# Altium project PCB_Project_1.PrjPcb
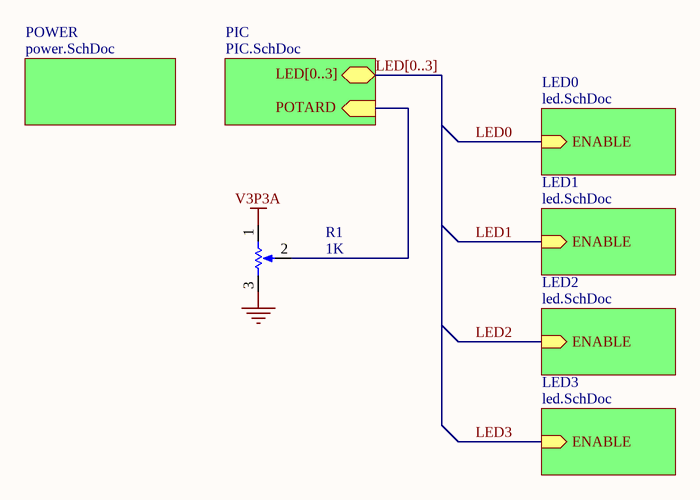
[diagram p0: TP2.SchDoc]
4 sheets, 34 parts. Net scope: hierarchical (ports join the sheet entries above them; power ports are global).
Sheets:
  TP2.SchDoc
    POWER = power.SchDoc
    PIC = PIC.SchDoc
    LED3 = led.SchDoc
    LED2 = led.SchDoc
    LED1 = led.SchDoc
    LED0 = led.SchDoc

## Sheet TP2.SchDoc
size A

### Parts
R1  1K  [PDB181-K415K-102A2]

### Sub-sheets
LED0 = led.SchDoc: ENABLE (in)
LED1 = led.SchDoc: ENABLE (in)
LED2 = led.SchDoc: ENABLE (in)
LED3 = led.SchDoc: ENABLE (in)
PIC = PIC.SchDoc: no entries
POWER = power.SchDoc: no entries

### Ports


### Nets
GND: R1.3(TOP)
V3P3A: R1.1(BOT)
NetR1_2: R1.2(TAP) ; port 

### Buses and harness runs
bus LED[0..3]
bus LED[0..3] = port 

### Notes on the sheet
- Labels drawn without touching a wire or pin: LED[0..3], POTARD

### Library data of the parts
R1 = RPot: Potentiometer; Sim Note: Enter the Resistance value and the set point into parameter fields.; Set Position: 0.5; Fabricant: BOURNS; Fournisseur: Farnell; RefFournisseur: 1823540; Published: 8-Jun-2000; LatestRevisionDate: 17-Jul-2002; LatestRevisionNote: Re-released for DXP Platform.; PackageReference: VR5; Publisher: Altium Limited; PackageDescription: Variable Resistor, Thru-Hole; 3 Leads; RefFabricant: PDB181-K415K-102A2

## Sheet power.SchDoc
size A
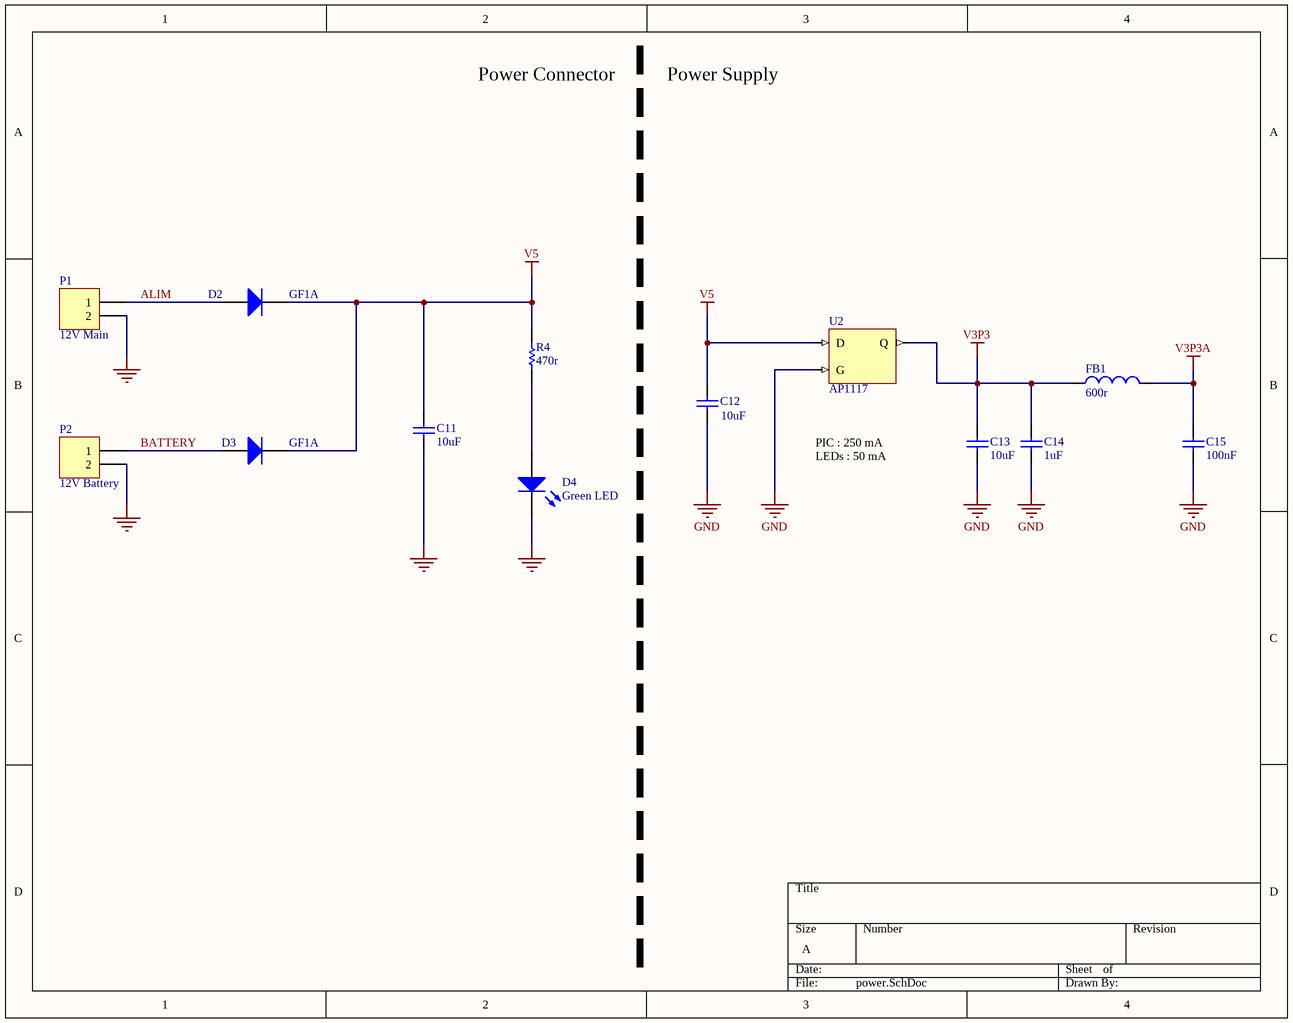
[diagram p1: power.SchDoc]

### Parts
C11  10uF  [CAPC2012N]
C12  10uF  [CAPC2012N]
C13  10uF  [CAPC2012N]
C14  1uF  [CAPC1608N]
C15  100nF  [RAD-0.3]
D2  GF1A  [SMA/DO-214AC_21]
D3  GF1A  [SMA/DO-214AC_21]
D4  Green LED  [LED 0805]
FB1  600r  [INDC1608AN]
P1  12V Main  [PHOENIX_1985195]
P2  12V Battery  [PHOENIX_1985195]
R4  470r  [RESC1608N]
U2  AP1117  [TD03B_N]

### Nets
GND: C11.1 C12.1 C13.1 C14.1 C15.1 D4.2(K) P1.2 P2.2 U2.G
V3P3: C13.2 C14.2 FB1.1 U2.Q
V3P3A: C15.2 FB1.2
V5: C11.2 C12.2 D2.2(K) D3.2(K) R4.2 U2.D
ALIM: D2.1(A) P1.1
BATTERY: D3.1(A) P2.1
NetD4_1: D4.1(A) R4.1

### Notes on the sheet
- Power Connector
- Power Supply
- PIC : 250 mA
- LEDs : 50 mA

### Library data of the parts
C11-C13 = Cap: Capacitor; Fabricant: TDK; RefFabricant: C2012X5R0J106M/1.25; Fournisseur: Farnell; RefFournisseur: 2309029; Precision: 6,3V X5R; Published: 8-Jun-2000; LatestRevisionDate: 17-Jul-2002; LatestRevisionNote: Re-released for DXP Platform.; PackageReference: RAD-0.3; Publisher: Altium Limited; PackageDescription: Radial Cap, Thru-Hole; 2 Leads; 0.3 in Pin Spacing; Value: 10uF
C14 = Cap: Capacitor; Precision: 6,3V X5R; Published: 8-Jun-2000; LatestRevisionDate: 17-Jul-2002; LatestRevisionNote: Re-released for DXP Platform.; PackageReference: RAD-0.3; Publisher: Altium Limited; PackageDescription: Radial Cap, Thru-Hole; 2 Leads; 0.3 in Pin Spacing; Value: 1uF
C15 = Cap: Capacitor; Value: 100pF; Published: 8-Jun-2000; LatestRevisionDate: 17-Jul-2002; LatestRevisionNote: Re-released for DXP Platform.; PackageReference: RAD-0.3; Publisher: Altium Limited; PackageDescription: Radial Cap, Thru-Hole; 2 Leads; 0.3 in Pin Spacing
D2 D3 = Diode: Default Diode; Fabricant: VISHAY; RefFabricant: GF1A-E3/67A; Fournisseur: Farnell; RefFournisseur: 9549560; Published: 8-Jun-2000; LatestRevisionDate: 17-Jul-2002; LatestRevisionNote: Re-released for DXP Platform.; PackageVersion: Sep-1996; PackageReference: SMC; Publisher: Altium Limited; PackageDescription: DO-214-AB/SMC; 2 C-Bend Leads; Body 7.9 x 5.9 mm, inc. leads (LxW); Code_JEDEC: DO-214-AB
D4 = LED2: Typical RED, GREEN, YELLOW, AMBER GaAs LED; Fabricant: KINGBRIGHT; RefFabricant: KPT-2012SGC; Fournisseur: Farnell; RefFournisseur: 2099239; Published: 8-Jun-2000; LatestRevisionDate: 17-Jul-2002; LatestRevisionNote: Re-released for DXP Platform.; PackageVersion: Feb-2002; PackageReference: 3.2X1.6X1.1; Publisher: Altium Limited; PackageDescription: SM LED; 2 Flat Leads
FB1 = Inductor: Code_IEC: 1005; Value: 10mH; Fabricant: Wurth; RefFabricant: 742792651; Fournisseur: Farnell; RefFournisseur: 1635706; Published: 8-Jun-2000; LatestRevisionDate: 29-May-2009; LatestRevisionNote: IPC-7351 Footprint Added.; PackageReference: 0402-A; Publisher: Altium Limited; PackageDescription: Chip Inductor; Code_JEITA: 0402
P1 P2 = Header 2: Header, 2-Pin; Fabricant: PHOENIX CONTACT; RefFabricant: PTSA 1.5/2-3,5-Z; Fournisseur: Farnell; RefFournisseur: 1792769; LatestRevisionDate: 17-Jul-2002; LatestRevisionNote: Re-released for DXP Platform.; Publisher: Altium Limited
R4 = Res1: Resistor; Value: 1K; Precision: 1%; Published: 8-Jun-2000; LatestRevisionDate: 17-Jul-2002; LatestRevisionNote: Re-released for DXP Platform.; PackageReference: AXIAL-0.3; Publisher: Altium Limited; PackageDescription: Axial Device, Thru-Hole; 2 Leads; 0.3 in Pin Spacing
U2 = LD: 1A LDO, 18V input, DPAK; FunctionalClass: Latch; ArchiveName: GENERIC; VHDLIB_SIM: GENERIC_LIB; Fabricant: DIODES INC; RefFabricant: AP1117D33G-13; Fournisseur: Farnell; RefFournisseur: 1825285; Published: 29-Jan-2004; Publisher: Altium Limited; XilinxEquivalent: LD; LastRevisionNo: 1.00.00; HelpURL: CR0118 FPGA Generic Library Guide.pdf#page=310; ComponentLink1URL: CR0135 FPGA Latch Resource Usage.pdf#page=2; ComponentLink1Description: Core &Resource Usage

## Sheet PIC.SchDoc
size A
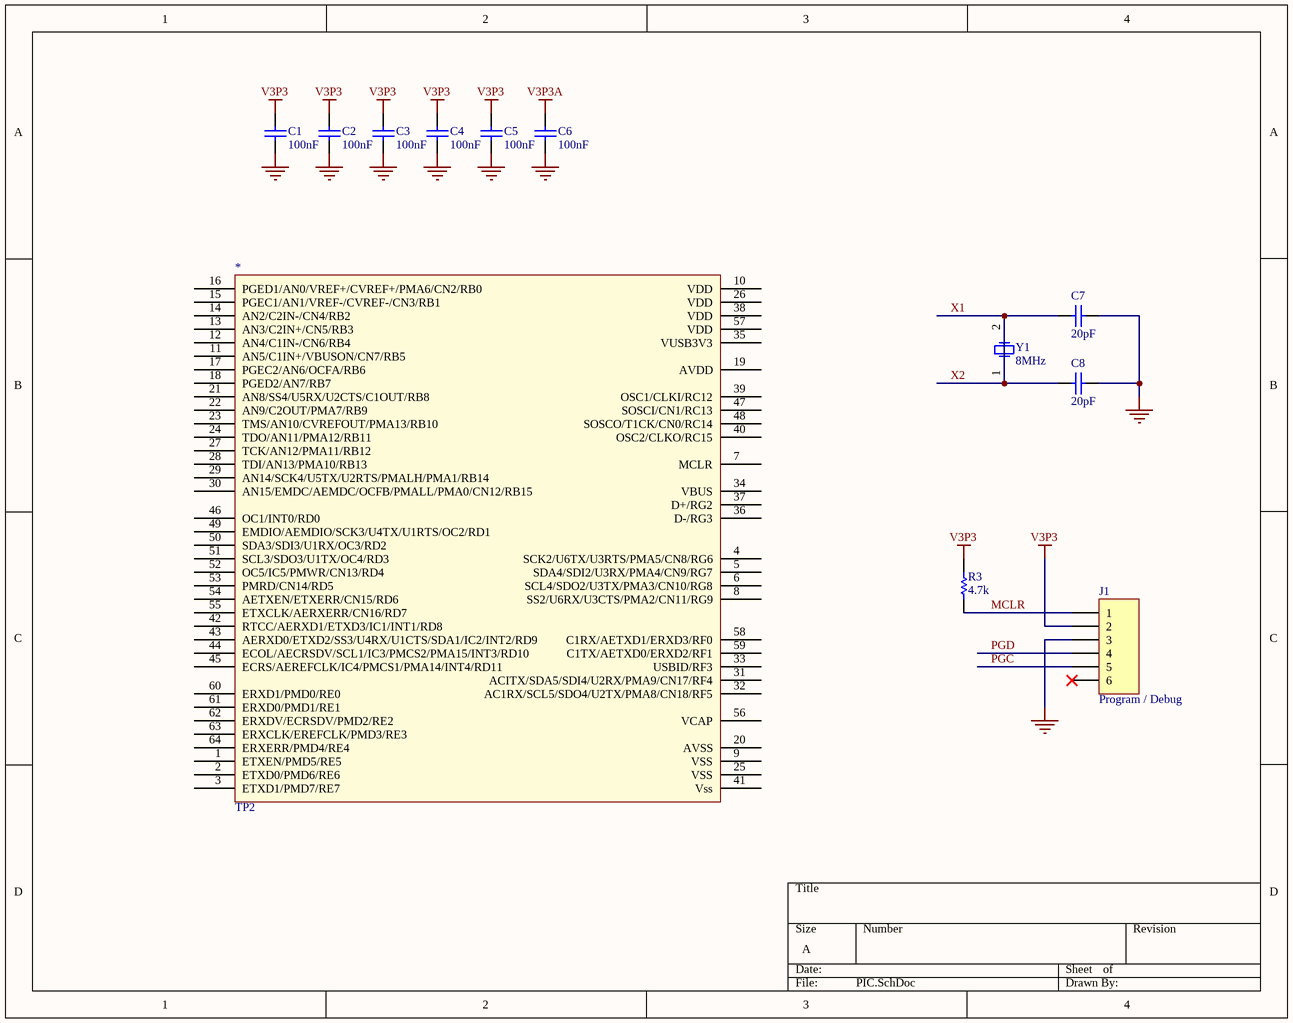
[diagram p2: PIC.SchDoc]

### Parts
*  TP2
C1  100nF  [CAPC1608N]
C2  100nF  [CAPC1608N]
C3  100nF  [CAPC1608N]
C4  100nF  [CAPC1608N]
C5  100nF  [CAPC1608N]
C6  100nF  [CAPC1608N]
C7  20pF  [CAPC1005N]
C8  20pF  [CAPC1005N]
J1  Program / Debug  [MOLEX 6P 1.25 CMS]
R3  4.7k  [RESC1608N]
Y1  8MHz  [XTAL139X50X45]

### Nets
GND: C1.1 C2.1 C3.1 C4.1 C5.1 C6.1 C7.2 C8.2 J1.3
V3P3: C1.2 C2.2 C3.2 C4.2 C5.2 J1.2 R3.2
V3P3A: C6.2
MCLR: J1.1 R3.1
PGC: J1.5
PGD: J1.4
X1: C7.1 C8.1 Y1.1(OSC1) Y1.2(OSC2)  [also labelled X2]

Not connected (* = marked no-connect by the designer): * 1(ETXEN/PMD5/RE5) 2(ETXD0/PMD6/RE6) 3(ETXD1/PMD7/RE7) 4(SCK2/U6TX/U3RTS/PMA5/CN8/RG6) 5(SDA4/SDI2/U3RX/PMA4/CN9/RG7) 6(SCL4/SDO2/U3TX/PMA3/CN10/RG8) 7(MCLR) 8(SS2/U6RX/U3CTS/PMA2/CN11/RG9) 9(VSS) 10(VDD) 11(AN5/C1IN+/VBUSON/CN7/RB5) 12(AN4/C1IN-/CN6/RB4) 13(AN3/C2IN+/CN5/RB3) 14(AN2/C2IN-/CN4/RB2) 15(PGEC1/AN1/VREF-/CVREF-/CN3/RB1) 16(PGED1/AN0/VREF+/CVREF+/PMA6/CN2/RB0) 17(PGEC2/AN6/OCFA/RB6) 18(PGED2/AN7/RB7) 19(AVDD) 20(AVSS) 21(AN8/SS4/U5RX/U2CTS/C1OUT/RB8) 22(AN9/C2OUT/PMA7/RB9) 23(TMS/AN10/CVREFOUT/PMA13/RB10) 24(TDO/AN11/PMA12/RB11) 25(VSS) 26(VDD) 27(TCK/AN12/PMA11/RB12) 28(TDI/AN13/PMA10/RB13) 29(AN14/SCK4/U5TX/U2RTS/PMALH/PMA1/RB14) 30(AN15/EMDC/AEMDC/OCFB/PMALL/PMA0/CN12/RB15) 31(ACITX/SDA5/SDI4/U2RX/PMA9/CN17/RF4) 32(AC1RX/SCL5/SDO4/U2TX/PMA8/CN18/RF5) 33(USBID/RF3) 34(VBUS) 35(VUSB3V3) 36(D-/RG3) 37(D+/RG2) 38(VDD) 39(OSC1/CLKI/RC12) 40(OSC2/CLKO/RC15) 41(Vss) 42(RTCC/AERXD1/ETXD3/IC1/INT1/RD8) 43(AERXD0/ETXD2/SS3/U4RX/U1CTS/SDA1/IC2/INT2/RD9) 44(ECOL/AECRSDV/SCL1/IC3/PMCS2/PMA15/INT3/RD10) 45(ECRS/AEREFCLK/IC4/PMCS1/PMA14/INT4/RD11) 46(OC1/INT0/RD0) 47(SOSCI/CN1/RC13) 48(SOSCO/T1CK/CN0/RC14) 49(EMDIO/AEMDIO/SCK3/U4TX/U1RTS/OC2/RD1) 50(SDA3/SDI3/U1RX/OC3/RD2) 51(SCL3/SDO3/U1TX/OC4/RD3) 52(OC5/IC5/PMWR/CN13/RD4) 53(PMRD/CN14/RD5) 54(AETXEN/ETXERR/CN15/RD6) 55(ETXCLK/AERXERR/CN16/RD7) 56(VCAP) 57(VDD) 58(C1RX/AETXD1/ERXD3/RF0) 59(C1TX/AETXD0/ERXD2/RF1) 60(ERXD1/PMD0/RE0) 61(ERXD0/PMD1/RE1) 62(ERXDV/ECRSDV/PMD2/RE2) 63(ERXCLK/EREFCLK/PMD3/RE3) 64(ERXERR/PMD4/RE4); J1 6*

### Library data of the parts
C1-C6 = Cap: Capacitor; Value: 100pF; Published: 8-Jun-2000; LatestRevisionDate: 17-Jul-2002; LatestRevisionNote: Re-released for DXP Platform.; PackageReference: RAD-0.3; Publisher: Altium Limited; PackageDescription: Radial Cap, Thru-Hole; 2 Leads; 0.3 in Pin Spacing
C7 = Cap: Capacitor; Value: 100pF; Precision: 50V X5R; Published: 8-Jun-2000; LatestRevisionDate: 17-Jul-2002; LatestRevisionNote: Re-released for DXP Platform.; PackageReference: RAD-0.3; Publisher: Altium Limited; PackageDescription: Radial Cap, Thru-Hole; 2 Leads; 0.3 in Pin Spacing
C8 = Cap: Capacitor; Precision: 50V X5R; Published: 8-Jun-2000; LatestRevisionDate: 17-Jul-2002; LatestRevisionNote: Re-released for DXP Platform.; PackageReference: RAD-0.3; Publisher: Altium Limited; PackageDescription: Radial Cap, Thru-Hole; 2 Leads; 0.3 in Pin Spacing
J1 = Header 6H: Header, 6-Pin, Right Angle; Fabricant: Molex; RefFabricant: 53398-0671; Fournisseur: Farnell; RefFournisseur: 1125368; LatestRevisionDate: 17-Jul-2002; LatestRevisionNote: Re-released for DXP Platform.; Publisher: Altium Limited
R3 = Res1: Resistor; Value: 1K; Precision: 1%; Published: 8-Jun-2000; LatestRevisionDate: 17-Jul-2002; LatestRevisionNote: Re-released for DXP Platform.; PackageReference: AXIAL-0.3; Publisher: Altium Limited; PackageDescription: Axial Device, Thru-Hole; 2 Leads; 0.3 in Pin Spacing
Y1 = XTAL: Crystal Oscillator; Fabricant: FOX ELECTRONICS; RefFabricant: FOXSDLF/080-20; Fournisseur: Farnell; RefFournisseur: 2063972; Published: 8-Jun-2000; LatestRevisionDate: 17-Jul-2002; LatestRevisionNote: Re-released for DXP Platform.; PackageReference: R38; Publisher: Altium Limited; PackageDescription: Crystal, Thru-Hole; 2 Leads; Body 3.1 x 8.2 mm (Dia.xH)

## Sheet led.SchDoc
size A
Used 4 times, as channels LED3, LED2, LED1, LED0. Parts and nets are listed once, with the designators drawn on the sheet.
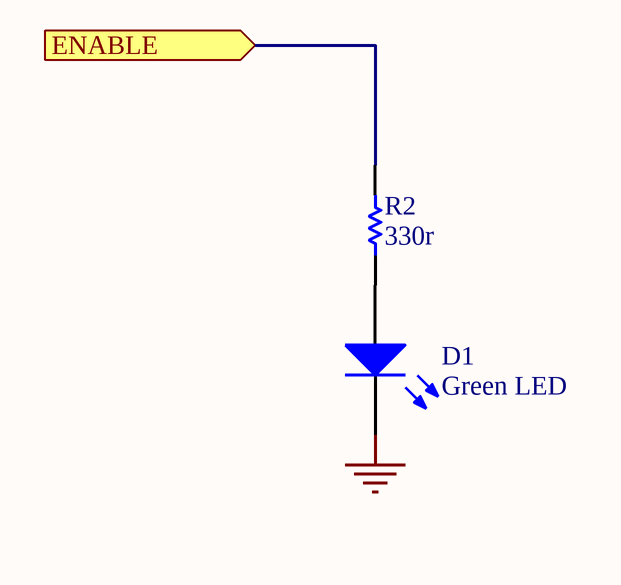
[diagram p3: led.SchDoc]

### Parts
D1  Green LED  [LED 0805]
R2  330r  [RESC1608N]

### Ports
ENABLE

### Nets
GND: D1.2(K)
ENABLE: R2.2 ; port ENABLE
NetD1_1: D1.1(A) R2.1

### Channels
LED3: designators end in _LED3; ports ENABLE=LED3
LED2: designators end in _LED2; ports ENABLE=LED2
LED1: designators end in _LED1; ports ENABLE=LED1
LED0: designators end in _LED0; ports ENABLE=LED0

### Library data of the parts
D1 = LED0: Typical INFRARED GaAs LED; Fabricant: KINGBRIGHT; RefFabricant: KPT-2012SGC; Fournisseur: Farnell; RefFournisseur: 2099239; Published: 8-Jun-2000; LatestRevisionDate: 08-Jul-2005; LatestRevisionNote: Mech Layer 1 removed.; PackageReference: LED-0; Publisher: Altium Limited; PackageDescription: LED; 2 Leads
R2 = Res1: Resistor; Value: 1K; Precision: 1%; Published: 8-Jun-2000; LatestRevisionDate: 17-Jul-2002; LatestRevisionNote: Re-released for DXP Platform.; PackageReference: AXIAL-0.3; Publisher: Altium Limited; PackageDescription: Axial Device, Thru-Hole; 2 Leads; 0.3 in Pin Spacing

## Nets that join several sheets
GND: TP2 (R1.3), power (9 pins), PIC (9 pins), LED3 (D1_LED3.2), LED2 (D1_LED2.2), LED1 (D1_LED1.2), LED0 (D1_LED0.2)
V3P3: power (C13.2 C14.2 FB1.1 U2.Q), PIC (7 pins)
V3P3A: TP2 (R1.1), power (C15.2 FB1.2), PIC (C6.2)